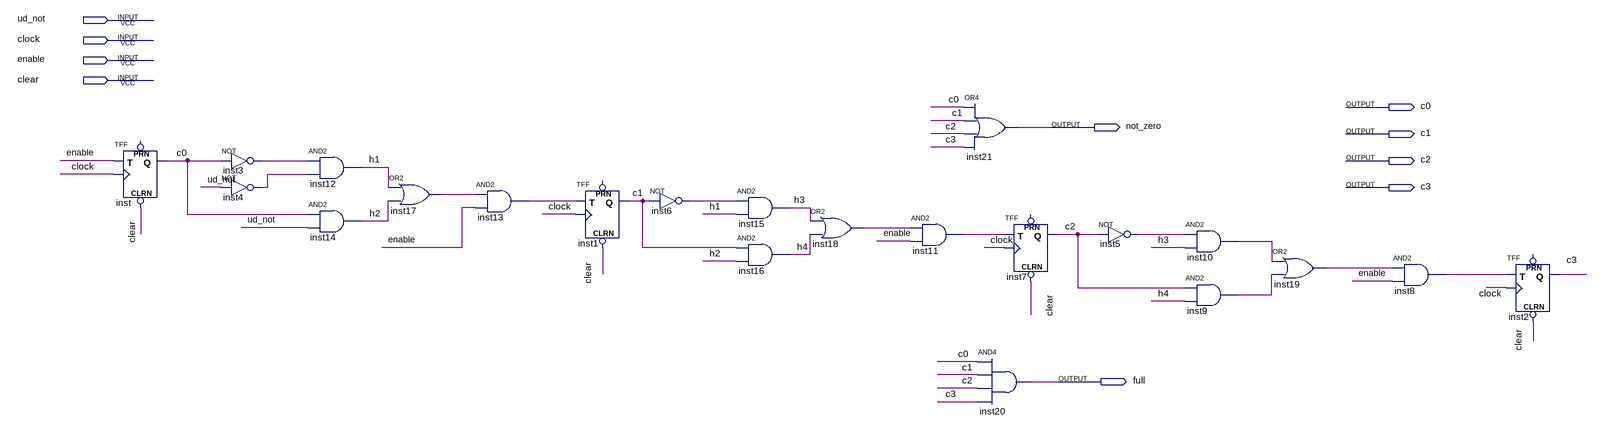
[diagram p0: schematic sheet]
// Quartus schematic Counter.bdf as structural Verilog: 22 symbols, 10 pins
module Counter (
  input  ud_not,
  input  clock,
  input  enable,
  input  clear,
  output c0,
  output not_zero,
  output c1,
  output c2,
  output c3,
  output full
);

  wire h1, h2, h3, h4, inst3_out, inst4_out, inst5_out, inst6_out, inst8_out, inst9_out, inst10_out,
       inst11_out, inst13_out, inst17_out, inst18_out, inst19_out;

  TFF inst (.CLRN(clear), .T(enable), .CLK(clock), .Q(c0));  // open: PRN
  not inst3 (inst3_out, c0);
  not inst4 (inst4_out, ud_not);
  and inst12 (h1, inst3_out, inst4_out);
  and inst14 (h2, c0, ud_not);
  or inst17 (inst17_out, h1, h2);
  and inst13 (inst13_out, inst17_out, enable);
  TFF inst1 (.CLRN(clear), .T(inst13_out), .CLK(clock), .Q(c1));  // open: PRN
  not inst6 (inst6_out, c1);
  and inst15 (h3, inst6_out, h1);
  and inst16 (h4, c1, h2);
  or inst18 (inst18_out, h3, h4);
  and inst11 (inst11_out, inst18_out, enable);
  or inst21 (not_zero, c0, c1, c2, c3);
  and inst20 (full, c0, c1, c2, c3);
  TFF inst7 (.CLRN(clear), .T(inst11_out), .CLK(clock), .Q(c2));  // open: PRN
  not inst5 (inst5_out, c2);
  and inst10 (inst10_out, inst5_out, h3);
  and inst9 (inst9_out, c2, h4);
  or inst19 (inst19_out, inst10_out, inst9_out);
  and inst8 (inst8_out, inst19_out, enable);
  TFF inst2 (.CLRN(clear), .T(inst8_out), .CLK(clock), .Q(c3));  // open: PRN
endmodule
